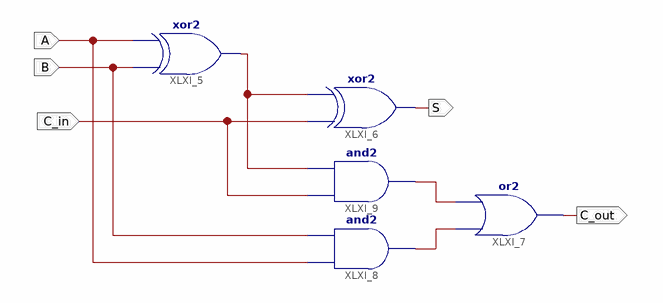
[diagram p0: schematic sheet 1]
// Xilinx ISE schematic FA.sch (virtex6) as structural Verilog: 5 symbols, 5 ports
module FA (
  input  A,
  input  B,
  input  C_in,
  output S,
  output C_out
);

  wire A_xor_B, XLXN_23, XLXN_24;

  xor XLXI_5 (A_xor_B, B, A);
  xor XLXI_6 (S, C_in, A_xor_B);
  or XLXI_7 (C_out, XLXN_24, XLXN_23);
  and XLXI_8 (XLXN_24, A, B);
  and XLXI_9 (XLXN_23, C_in, A_xor_B);
endmodule
